# Altium schematic sheet Sheet1.SchDoc
size 199 x 149 mm; SheetNumber: 1; SheetTotal: 1
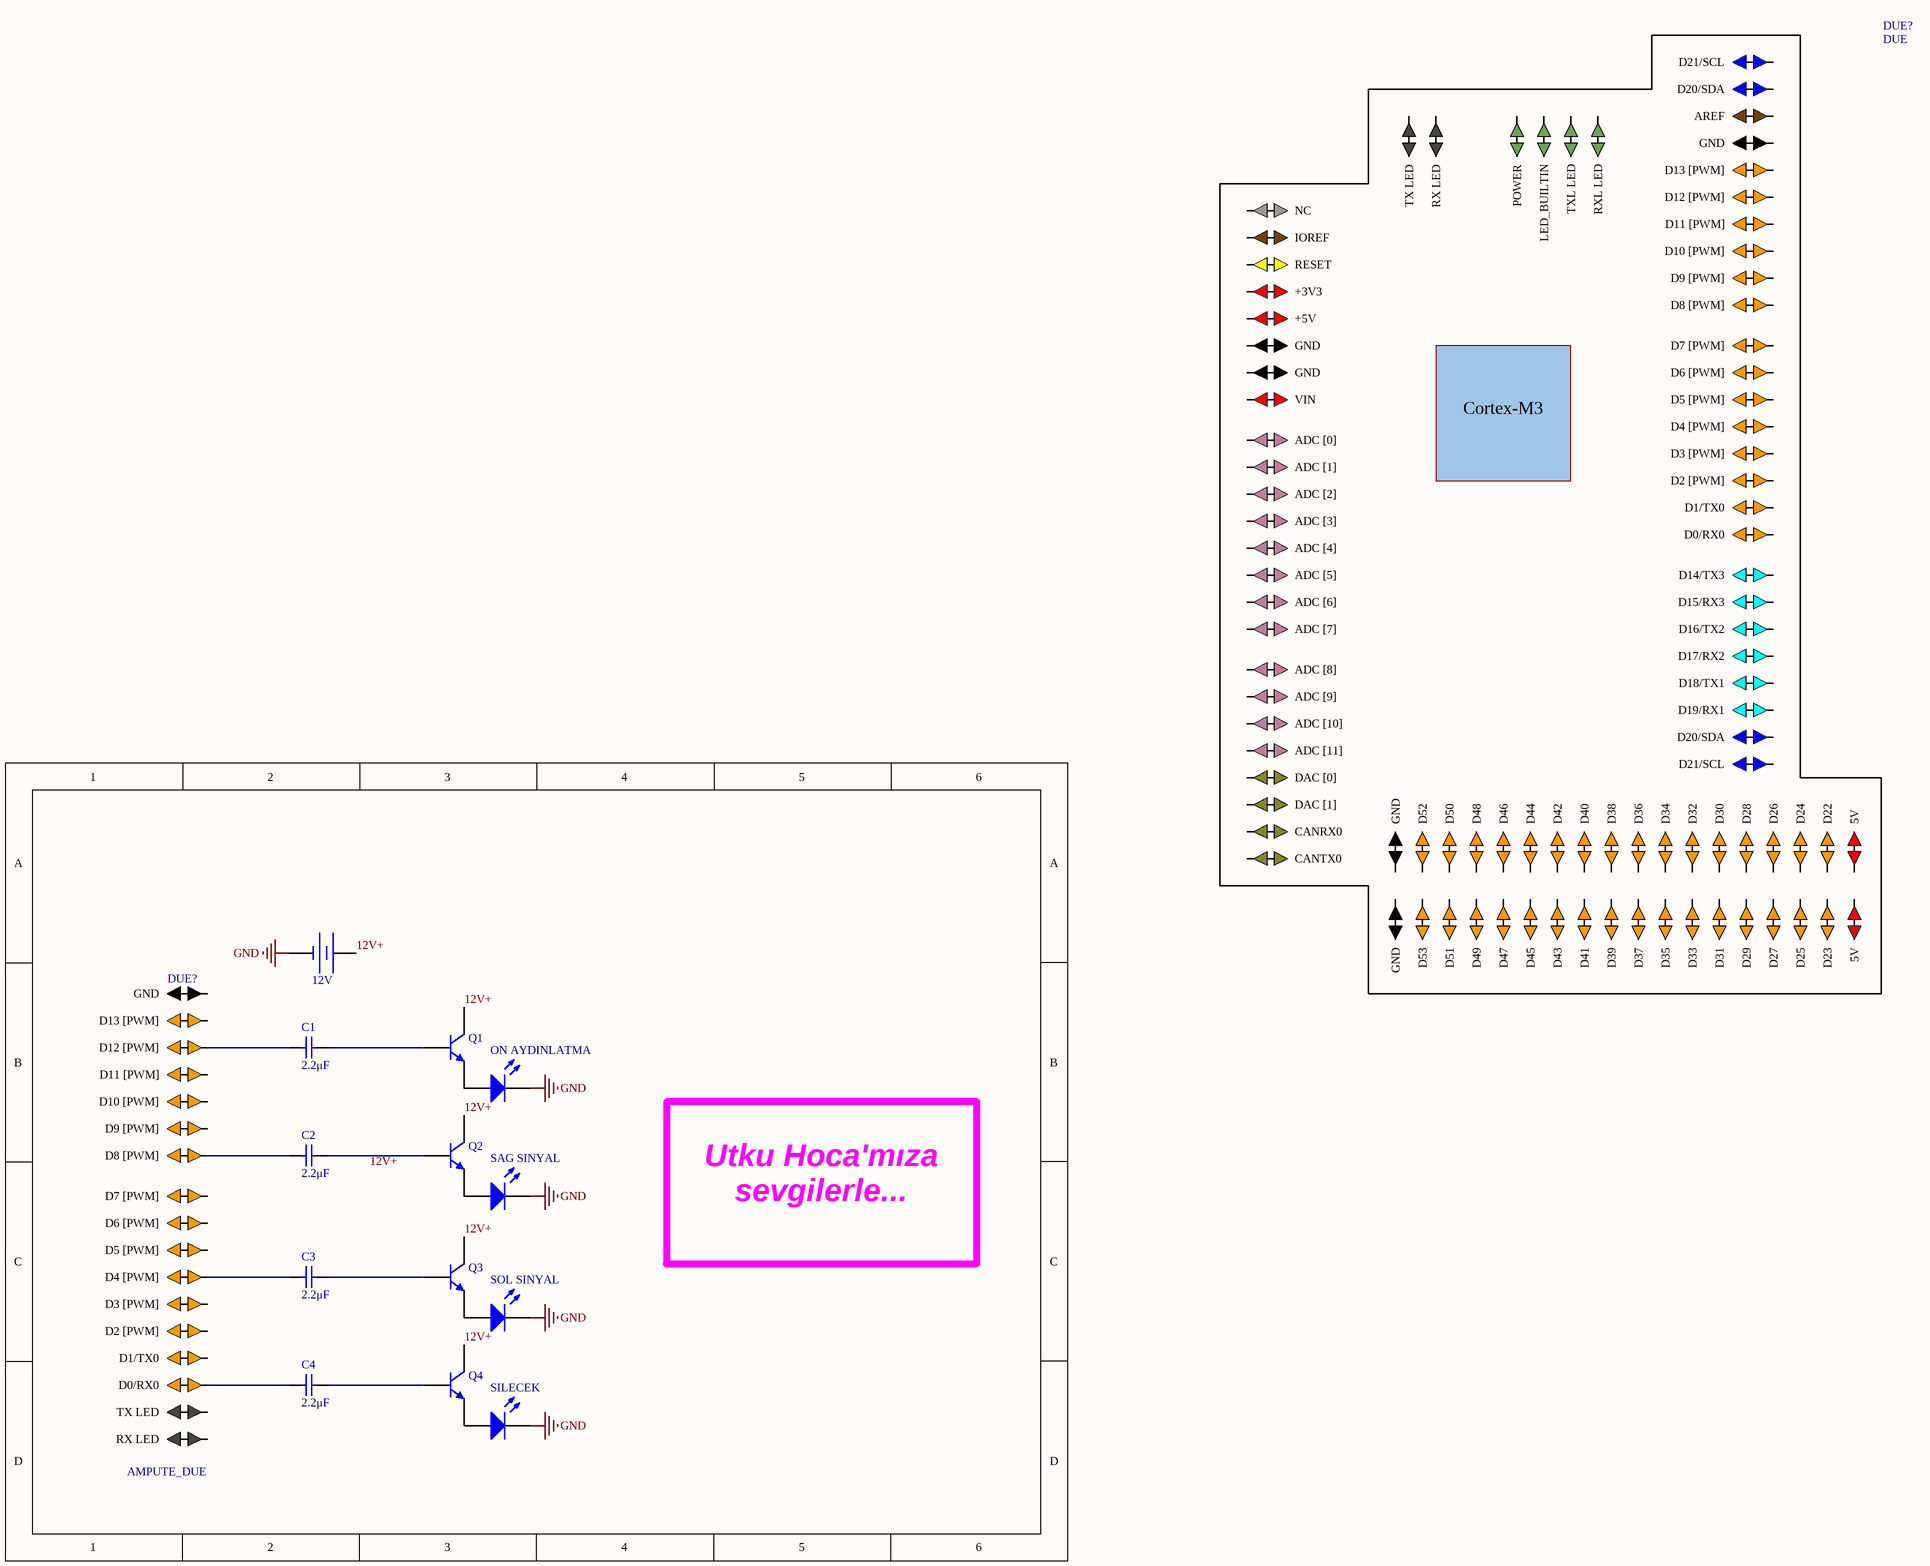
[diagram p0: Sheet1.SchDoc]

## Parts
(Parts that share a designator on the sheet are numbered #1, #2 ... from top to bottom, then left to right.)
C1  value 2.2μF  (hidden comment: Capacitor)
C2  value 2.2μF  (hidden comment: Capacitor)
C3  value 2.2μF  (hidden comment: Capacitor)
C4  value 2.2μF  (hidden comment: Capacitor)
DUE?#1  DUE  [ARDUINO DUE]
DUE?#2  AMPUTE_DUE  [ARDUINO DUE]
ON_AYDINLATMA  Light-Emitting Diode  (value not drawn)
Q1  Bipolar NPN 3 Pins Transistor VBIC Model  (value not drawn)
Q2  Bipolar NPN 3 Pins Transistor VBIC Model  (value not drawn)
Q3  Bipolar NPN 3 Pins Transistor VBIC Model  (value not drawn)
Q4  Bipolar NPN 3 Pins Transistor VBIC Model  (value not drawn)
SAG_SINYAL  Light-Emitting Diode  (value not drawn)
SILECEK  Light-Emitting Diode  (value not drawn)
SOL_SINYAL  Light-Emitting Diode  (value not drawn)
V1  DC Magnitude: 12V  (hidden comment: Constant Voltage Source)

## Nets
GND: ON_AYDINLATMA.2(K) SAG_SINYAL.2(K) SILECEK.2(K) SOL_SINYAL.2(K) V1.2
12V+: Q1.1(C) Q2.1(C) Q3.1(C) Q4.1(C) V1.1
NetC1_1: C1.1 DUE?#2.81(D12_[PWM])
NetC1_2: C1.2 Q1.2(B)
NetC2_1: C2.1 DUE?#2.77(D8_[PWM])
NetC2_2: C2.2 Q2.2(B)
NetC3_1: C3.1 DUE?#2.73(D4_[PWM])
NetC3_2: C3.2 Q3.2(B)
NetC4_1: C4.1 DUE?#2.69(D0/RX0)
NetC4_2: C4.2 Q4.2(B)
NetON_AYDINLATMA_1: ON_AYDINLATMA.1(A) Q1.3(E)
NetQ2_3: Q2.3(E) SAG_SINYAL.1(A)
NetQ3_3: Q3.3(E) SOL_SINYAL.1(A)
NetQ4_3: Q4.3(E) SILECEK.1(A)

Not connected (* = marked no-connect by the designer): DUE?#1 1(NC) 2(IOREF) 3(RESET) 4(+3V3) 5(+5V) 6(GND) 7(GND) 8(VIN) 9(ADC_[0]) 10(ADC_[1]) 11(ADC_[2]) 12(ADC_[3]) 13(ADC_[4]) 14(ADC_[5]) 15(ADC_[6]) 16(ADC_[7]) 17(ADC_[8]) 18(ADC_[9]) 19(ADC_[10]) 20(ADC_[11]) 21(DAC_[0]) 22(DAC_[1]) 23(CANRX0) 24(CANTX0) 25(GND) 26(GND) 27(D52) 28(D53) 29(D50) 30(D51) 31(D48) 32(D49) 33(D46) 34(D47) 35(D44) 36(D45) 37(D42) 38(D43) 39(D40) 40(D41) 41(D38) 42(D39) 43(D36) 44(D37) 45(D34) 46(D35) 47(D32) 48(D33) 49(D30) 50(D31) 51(D28) 52(D29) 53(D26) 54(D27) 55(D24) 56(D25) 57(D22) 58(D23) 59(5V) 60(5V) 61(D21/SCL) 62(D20/SDA) 63(D19/RX1) 64(D18/TX1) 65(D17/RX2) 66(D16/TX2) 67(D15/RX3) 68(D14/TX3) 69(D0/RX0) 70(D1/TX0) 71(D2_[PWM]) 72(D3_[PWM]) 73(D4_[PWM]) 74(D5_[PWM]) 75(D6_[PWM]) 76(D7_[PWM]) 77(D8_[PWM]) 78(D9_[PWM]) 79(D10_[PWM]) 80(D11_[PWM]) 81(D12_[PWM]) 82(D13_[PWM]) 83(GND) 84(AREF) 85(D20/SDA) 86(D21/SCL) ?1(POWER) ?2(LED_BUILTIN) ?3(TXL_LED) ?4(RXL_LED) ?5(TX_LED) ?6(RX_LED); DUE?#2 70(D1/TX0) 71(D2_[PWM]) 72(D3_[PWM]) 74(D5_[PWM]) 75(D6_[PWM]) 76(D7_[PWM]) 78(D9_[PWM]) 79(D10_[PWM]) 80(D11_[PWM]) 82(D13_[PWM]) 83(GND) ?1(TX_LED) ?2(RX_LED)

## Notes on the sheet
- Utku Hoca'mıza sevgilerle...
- Labels drawn without touching a wire or pin: 12V+
- (in symbol DUE) Cortex-M3

## Library data of the parts
C1-C4 = Capacitor: SimulationGenericComponent: True
ON_AYDINLATMA SAG_SINYAL SILECEK SOL_SINYAL = LED: AF: 1; BV: 0; BV_MAX: 1e99; EG: 1.11; FC: 0.5; IBV: 0.001; IS: 1e-14; MJSW: 0.33; NTUN: 30; TNOM: 27; XTI: 3; SimulationGenericComponent: True; CJO: 0; CJP: 0; CTA: 0; CTP: 0; FCS: 0.5; FV_MAX: 1e99; IKF: 0; IKR: 0; ISR: 1e-14; JSW: 0; JTUN: 0; JTUNSW: 0; KEG: 1; KF: 0; LEVEL: 1; N: 1; NBV: 1; NR: 1; NS: 1; PHP: 1; RS: 0; TCV: 0; TLEV: 0; TLEVC: 0; TM1: 0; TM2: 0; TPB: 0; TPHP: 0; TRS: 0; TRS2: 0; TT: 0; TTT1: 0; TTT2: 0; VJ: 1; XTITUN: 3
Q1-Q4 = BJT NPN VBIC: SimulationGenericComponent: True; AFN: 1; AJC: -0.5; ART: 0.1; AVC1: 0; EA: 1.12; FC: 0.9; IBBE: 1e-06; IBCI: 1e-16; IBEI: 1e-18; MC: 0.33; NCN: 2; NKF: 0.5; PC: 0.75; TNOM: 27; VERS: 1.2; XII: 3; AJE: -0.5; AJS: -0.5; AVC2: 0; BFN: 1; CBCO: 0; CBEO: 0; CCSO: 0; CJC: 0; CJCP: 0; CJE: 0; CJEP: 0; CTH: 0; DEAR: 0; EAIC: 1.12; EAIE: 1.12; EAIS: 1.12; EANC: 1.12; EANE: 1.12; EANS: 1.12; EAP: 1.12; EBBE: 0; GAMM: 0; HRCF: 1; IBCIP: 0; IBCN: 0; IBCNP: 0; IBEIP: 0; IBEN: 0; IBENP: 0; IKF: 0; IKP: 0; IKR: 0; IS: 1e-16; ISP: 0; ISRR: 1; ITF: 0; KFN: 0; ME: 0.33; MS: 0.33; NBBE: 1; NCI: 1; NCIP: 1; NCNP: 2; NEI: 1; NEN: 2; NF: 1; NFP: 1; NR: 1; PE: 0.75; PS: 0.75; QBM: 0; QCO: 0; QTF: 0; RBI: 0.1; RBP: 0.1; RBX: 0; RCI: 0.1; RCX: 0; RE: 0; RS: 0; RTH: 0; TAVC: 0; TD: 0; TF: 0; TNBBE: 0; TNF: 0; TR: 0; TVBBE1: 0; TVBBE2: 0; VBBE: 0; VEF: 0; VER: 0; VO: 0; VREF: 0; VRT: 0; VTF: 0; WBE: 1; WSP: 1; XIKF: 0; XIN: 3; XIS: 3; XISR: 0; XRBI: 0; XRBP: 0; XRBX: 0; XRCI: 0; XRCX: 0; XRE: 0; XRS: 0; XTF: 0; XVO: 0
V1 = Battery: SimulationGenericComponent: True